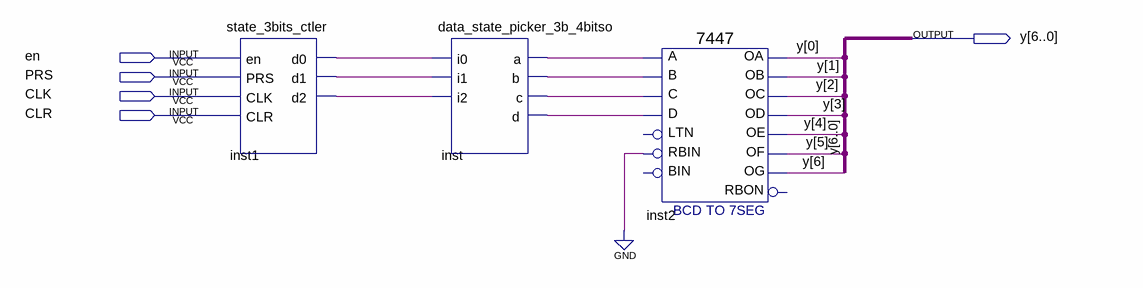
[diagram p0: schematic sheet]
// Quartus schematic fsm_main.bdf as structural Verilog: 3 symbols, 5 pins
module fsm_main (
  input  en,
  input  PRS,
  input  CLK,
  input  CLR,
  output [6:0] y
);

  wire inst1_d0, inst1_d1, inst1_d2, inst_a, inst_b, inst_c, inst_d;

  state_3bits_ctler inst1 (.en(en), .PRS(PRS), .CLK(CLK), .CLR(CLR), .d0(inst1_d0), .d1(inst1_d1), .d2(inst1_d2));
  data_state_picker_3b_4bitso inst (
    .i0(inst1_d0), .i1(inst1_d1), .i2(inst1_d2), .a(inst_a), .b(inst_b), .c(inst_c), .d(inst_d));
  \7447  inst2 (
    .B(inst_b), .C(inst_c), .D(inst_d), .RBIN(1'b0), .A(inst_a), .OB(y[1]), .OC(y[2]), .OE(y[4]), .OD(y[3]),
    .OF(y[5]), .OG(y[6]), .OA(y[0]));  // open: LTN, BIN, RBON
endmodule
